# EAGLE schematic kiss_z_alt (EAGLE 8.6.0)
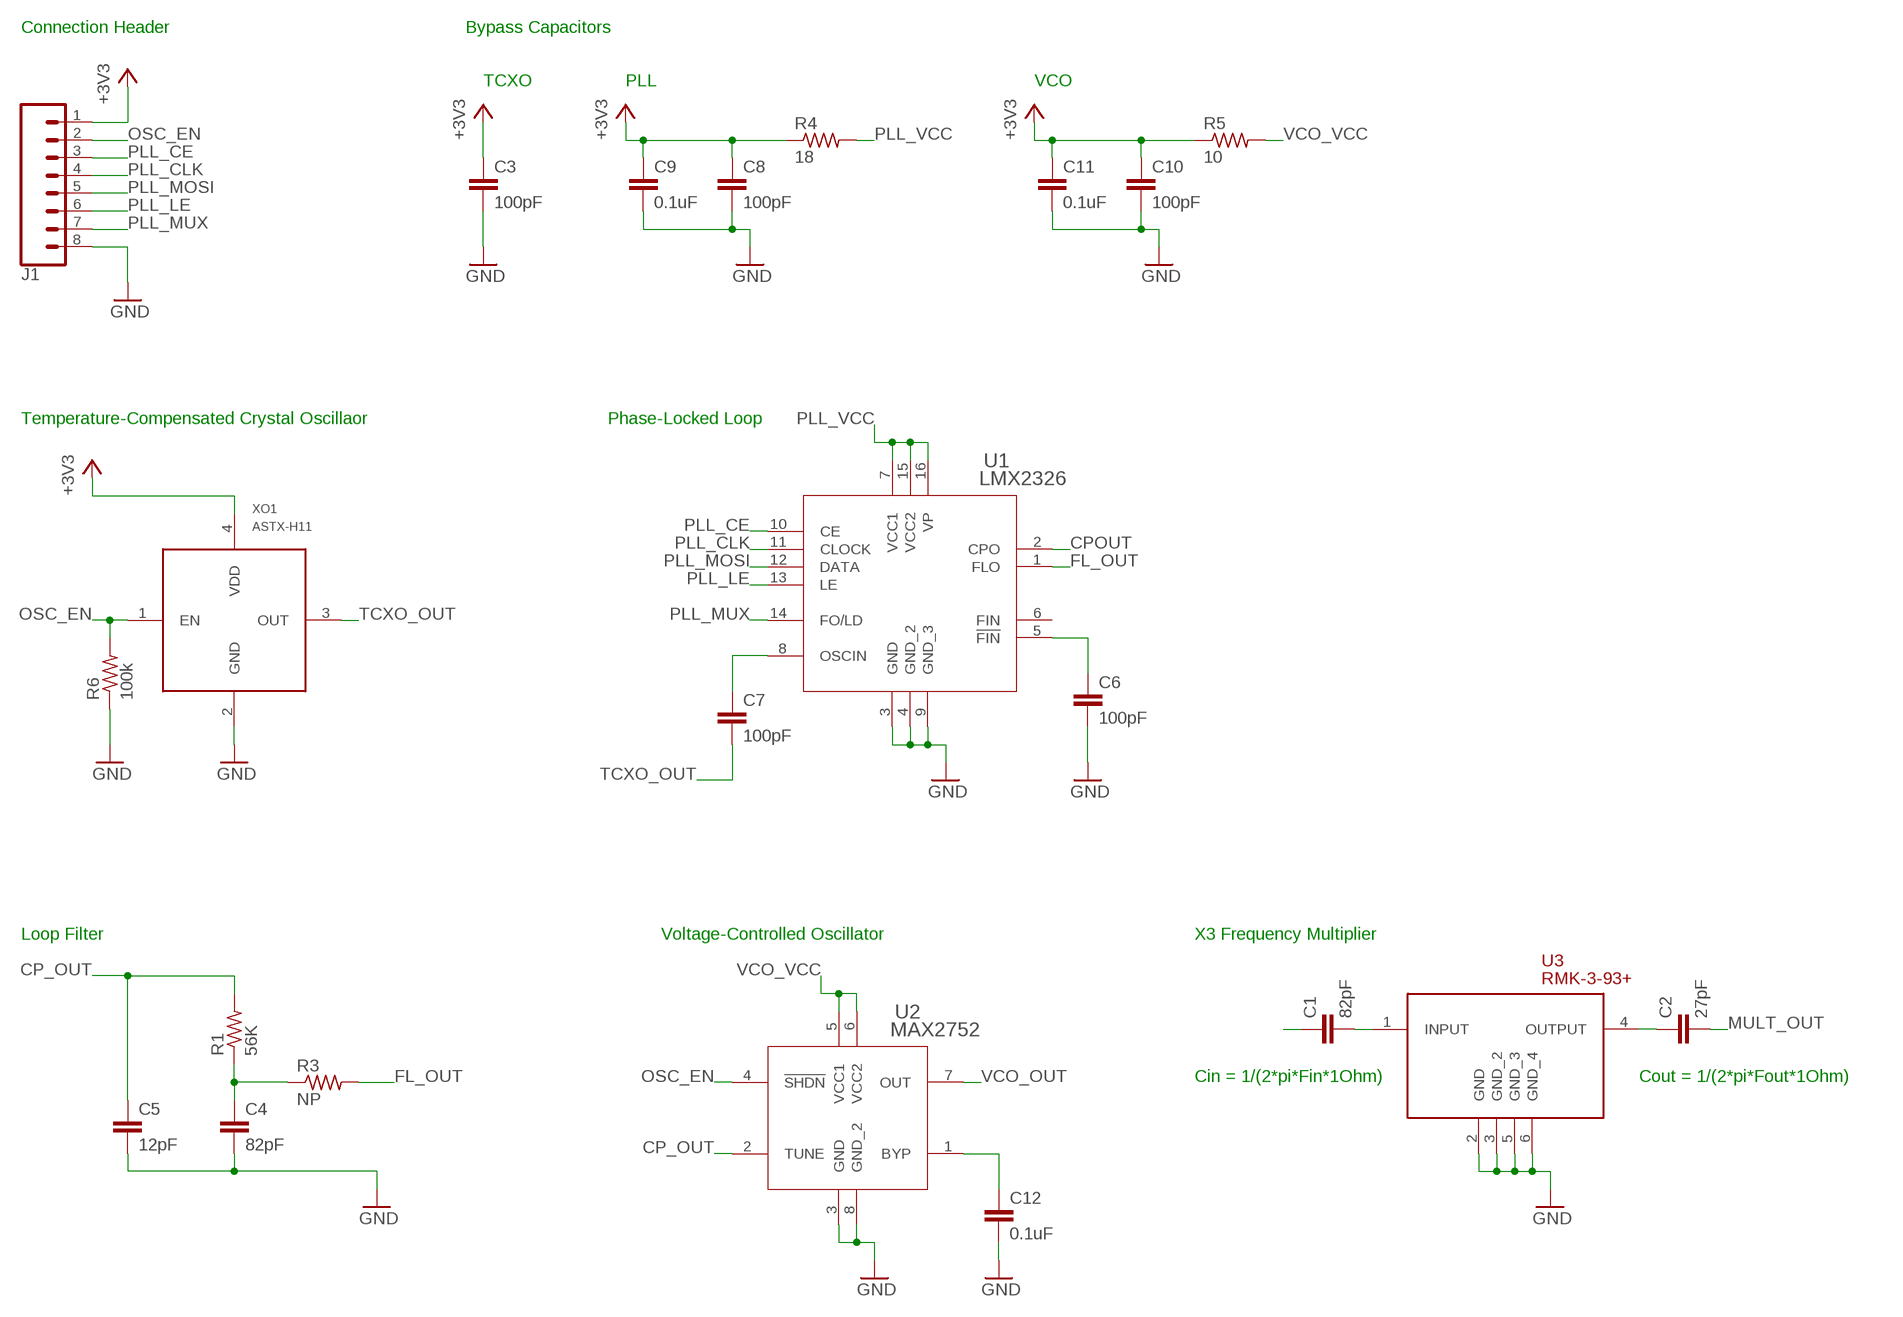
[diagram p0: schematic, sheet 1]

## Parts
C1  82pF  C0603  [0603]
C2  27pF  C0603  [0603]
C3  100pF  C0603  [0603]
C4  82pF  C0603  [0603]
C5  12pF  C0603  [0603]
C6  100pF  C0603  [0603]
C7  100pF  C0603  [0603]
C8  100pF  C0603  [0603]
C9  0.1uF  C0603  [0603]
C10  100pF  C0603  [0603]
C11  0.1uF  C0603  [0603]
C12  0.1uF  C0603  [0603]
J1  CONN_08"  [1X08]
R1  56K  R0603  [0603]
R3  NP  R0603  [0603]
R4  18  R0603  [0603]
R5  10  R0603  [0603]
R6  100k  R0603  [0603]
U1  LMX2326  [MTC16]
U2  MAX2752  [21-0036K]
U3  RMK-3-93+  [TT1224]
XO1  ASTX-H11  [ASTX-H11]

## Nets
+3V3: C3.1 C8.1 C9.1 C10.1 C11.1 J1.1 R4.1 R5.1 XO1.4(VDD)
CP_OUT: C5.1 R1.2 U2.2(TUNE)
CPOUT: U1.2(CPO)
FL_OUT: R3.2 U1.1(FLO)
GND: C3.2 C4.2 C5.2 C6.2 C8.2 C9.2 C10.2 C11.2 C12.2 J1.8 R6.1 U1.3(GND) U1.4(GND_2) U1.9(GND_3) U2.3(GND) U2.8(GND_2) U3.2(GND) U3.3(GND_2) U3.5(GND_3) U3.6(GND_4) XO1.2(GND)
MULT_OUT: C2.2
N$1: C1.2 U3.1(INPUT)
N$2: C2.1 U3.4(OUTPUT)
N$3: C4.1 R1.1 R3.1
N$5: C6.1 U1.5(!FIN)
N$7: C12.1 U2.1(BYP)
N$10: C7.1 U1.8(OSCIN)
OSC_EN: J1.2 R6.2 U2.4(!SHDN) XO1.1(EN)
PLL_CE: U1.10(CE)
PLL_CLK: U1.11(CLOCK)
PLL_LE: U1.13(LE)
PLL_MOSI: U1.12(DATA)
PLL_MUX: J1.7 U1.14(FO/LD)
PLL_VCC: R4.2 U1.7(VCC1) U1.15(VCC2) U1.16(VP)
TCXO_OUT: C7.2 XO1.3(OUT)
VCO_OUT: C1.1 U2.7(OUT)
VCO_VCC: R5.2 U2.5(VCC1) U2.6(VCC2)
Unconnected: J1.3 J1.4 J1.5 J1.6 U1.6(FIN)

## Notes on the sheet
- Connection Header | Bypass Capacitors
- TCXO | PLL | VCO
- Temperature-Compensated Crystal Oscillaor | Phase-Locked Loop
- Loop Filter | Voltage-Controlled Oscillator | X3 Frequency Multiplier
- Cin = 1/(2*pi*Fin*1Ohm) | Cout = 1/(2*pi*Fout*1Ohm)

## Library data of the parts
C1-C12 = kiss_z:C0603
J1 = SparkFun-Connectors:CONN_08: Multi connection point. Often used as Generic Header-pin footprint for 0.1 inch spaced/style header connections On any of the 0.1 inch spaced packages, you can populate with these: Break Away Headers - Straight <https://www.sparkfun.com/products/116> (PRT-00116) Break Away Male Headers - Right Angle <https://www.sparkfun.com/products/553> (PRT-00553) Female Headers <https://www.sparkfun.com/products/115> (PRT-00115) Break Away Headers - Machine Pin <https://www.sparkfun.com/products/117> (PRT-00117) Break Away Female Headers - Swiss Machine Pin <https://www.sparkfun.com/products/743> (PRT-00743) Arduino Stackable Header - 8 Pin <https://www.sparkfun.com/products/9279> (PRT-09279) For SCREWTERMINALS and SPRING TERMINALS visit here: Screw Terimnals on SparkFun.com <https://www.sparkfun.com/search/results?term=Screw+Terminals> (5mm/3.5mm/2.54mm spacing) This device is also useful as a general connection point to wire up your design to another part of your project. Our various solder wires solder well into these plated through hole pads. Hook-Up Wire - Assortment (Stranded, 22 AWG) <https://www.sparkfun.com/products/11375> (PRT-11375) Hook-Up Wire - Assortment (Solid Core, 22 AWG) <https://www.sparkfun.com/products/11367> (PRT-11367) View the entire wire category on our website here <https://www.sparkfun.com/categories/141> Special notes: Molex polarized connector foot print use with SKU : PRT-08231 with associated crimp pins and housings. 1MM SMD Version SKU: PRT-10208 NOTES ON THE VARIANTS LOCK and LOCK_LONGPADS... This footprint was designed to help hold the alignment of a through-hole component (i.e. 6-pin header) while soldering it into place. You may notice that each hole has been shifted either up or down by 0.005 of an inch from it's more standard position (which is a perfectly straight line). This slight alteration caused the pins (the squares in the middle) to touch the edges of the holes. Because they are alternating, it causes a "brace" to hold the component in place. 0.005 has proven to be the perfect amount of "off-center" position when using our standard breakaway headers. Although looks a little odd when you look at the bare footprint, once you have a header in there, the alteration is very hard to notice. Also,if you push a header all the way into place, it is covered up entirely on the bottom side.; PROD_ID: CONN-08438
R1 R3-R6 = kiss_z:R0603
U1 = kiss_z:LMX2326
U2 = kiss_z:MAX2752
U3 = kiss_z:RMK-3-93+
XO1 = kiss_z:ASTX-H11